# EAGLE design ftdi (EAGLE 6.1)
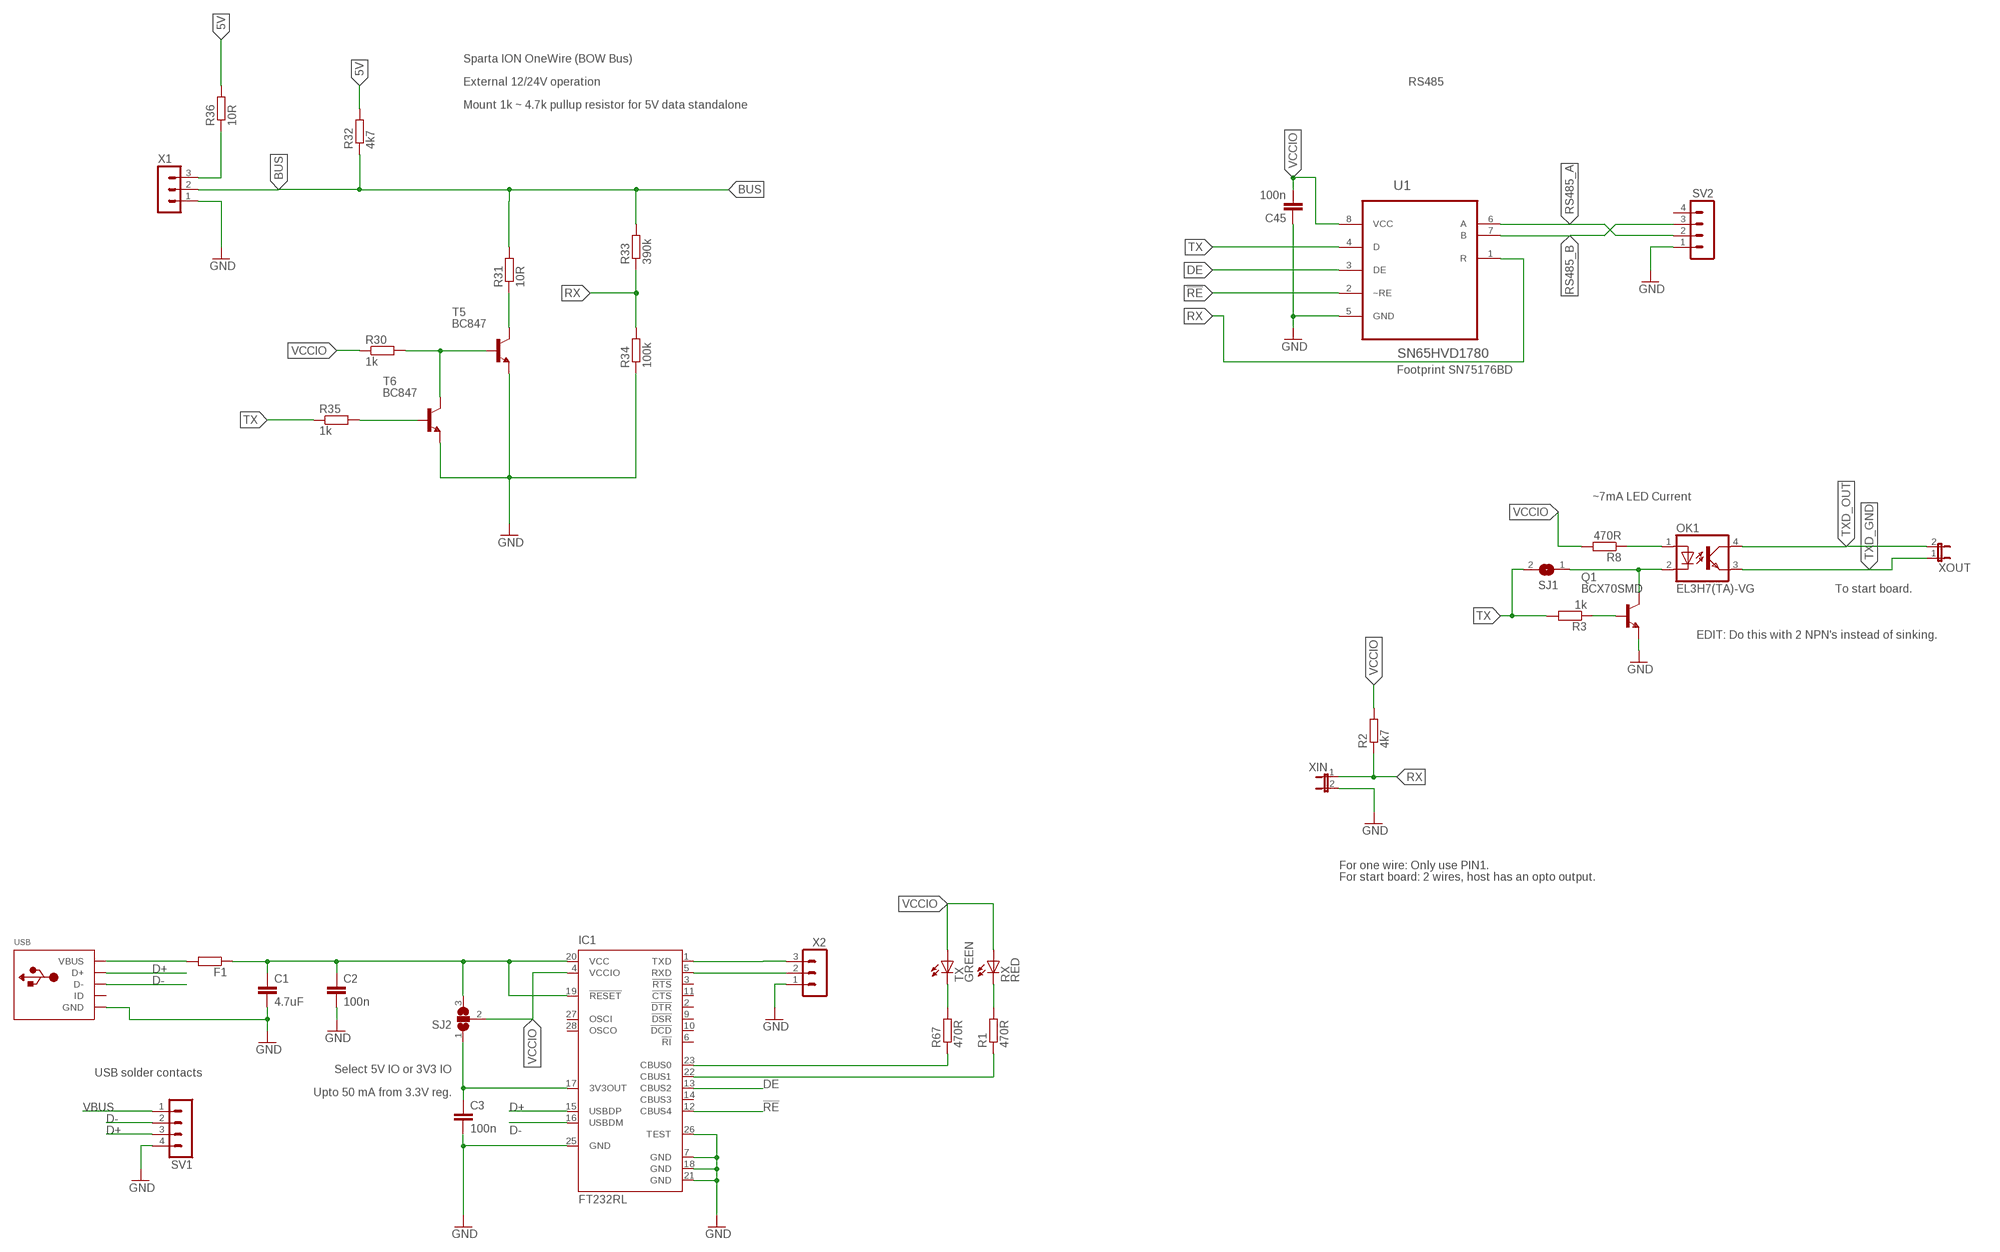
[diagram p0: schematic, sheet 1]

## Parts
C1  4.7uF  C-EUC0805  [C0805]
C2  100n  C-EUC0805  [C0805]
C3  100n  C-EUC0805  [C0805]
C45  100n  C-EUC0805  [C0805]
F1  R-EU_R0805  [R0805]
IC1  FT232RL  [SSOP28]
OK1  EL3H7(TA)-VG  TLP283  [MINI-FLAT-4]
Q1  BCX70SMD  [SOT23]
R1  470R  R-EU_M0805  [M0805]
R2  4k7  R-EU_R0805  [R0805]
R3  1k  R-EU_R0805  [R0805]
R8  470R  R-EU_R0805  [R0805]
R30  1k  R-EU_M0805  [M0805]
R31  10R  R-EU_M0805  [M0805]
R32  4k7  R-EU_M0805  [M0805]
R33  390k  R-EU_M0805  [M0805]
R34  100k  R-EU_M0805  [M0805]
R35  1k  R-EU_M0805  [M0805]
R36  10R  R-EU_M0805  [M0805]
R67  470R  R-EU_M0805  [M0805]
RX  RED  LEDCHIPLED_0805  [CHIPLED_0805]
SJ1  SJ  [SJ]
SJ2  SJ2W  [SJ_2]
SV1  MA04-1  [MA04-1]
SV2  MA04-1  [MA04-1]
T5  BC847  [SOT23]
T6  BC847  [SOT23]
TX  GREEN  LEDCHIPLED_0805  [CHIPLED_0805]
U1  SN65HVD1780  SN75176BD  [SOIC127P600X175-8N]
USB  ADAFRUIT_USBMINIB  [ADAFRUIT_USB-MINIB]
X1  MA03-1  [MA03-1]
X2  MA03-1  [MA03-1]
XIN  JP1E  [JP1]
XOUT  JP1E  [JP1]

## Nets
5V: C1.1 C2.1 F1.1 IC1.19(!RESET) IC1.20(VCC) R32.2 R36.2 SJ2.3
!RE: IC1.12(CBUS4) U1.2(~RE)
BUS: R31.2 R32.1 R33.2 X1.2
D+: IC1.15(USBDP) SV1.3 USB.D+
D-: IC1.16(USBDM) SV1.2 USB.D-
DE: IC1.13(CBUS2) U1.3(DE)
GND: C1.2 C2.2 C3.2 C45.1 IC1.7(GND) IC1.18(GND) IC1.21(GND) IC1.25(GND) IC1.26(TEST) Q1.2(E) R34.1 SV1.4 SV2.1 T5.2(E) T6.2(E) U1.5(GND) USB.GND X1.1 X2.1 XIN.2
GND1: IC1.23(CBUS0) R67.1
GND2: IC1.22(CBUS1) R1.1
N$1: C3.1 IC1.17(3V3OUT) SJ2.1
N$3: R1.2 RX.C
N$5: OK1.2(C) Q1.3(C) SJ1.1
N$6: OK1.1(A) R8.1
N$10: Q1.1(B) R3.1
N$14: R31.1 T5.3(C)
N$23: R35.2 T6.1(B)
N$25: R30.2 T5.1(B) T6.3(C)
N$28: R36.1 X1.3
N$74: R67.2 TX.C
RS485_A: SV2.2 U1.6(A)
RS485_B: SV2.3 U1.7(B)
RX: IC1.5(RXD) R2.1 R33.1 R34.2 U1.1(R) X2.2 XIN.1
TX: IC1.1(TXD) R3.2 R35.1 SJ1.2 U1.4(D) X2.3
TXD_GND: OK1.3(EMIT) XOUT.1
TXD_OUT: OK1.4(COL) XOUT.2
VBUS: F1.2 SV1.1 USB.VBUS
VCCIO: C45.2 IC1.4(VCCIO) R2.2 R8.2 R30.1 RX.A SJ2.2 TX.A U1.8(VCC)
Unconnected: IC1.2(!DTR) IC1.3(!RTS) IC1.6(!RI) IC1.9(!DSR) IC1.10(!DCD) IC1.11(!CTS) IC1.14(CBUS3) IC1.27(OSCI) IC1.28(OSCO) SV2.4 USB.ID

## Notes on the sheet
- Sparta ION OneWire (BOW Bus)
- External 12/24V operation | RS485
- Mount 1k ~ 4.7k pullup resistor for 5V data standalone
- Footprint SN75176BD
- ~7mA LED Current
- To start board.
- EDIT: Do this with 2 NPN's instead of sinking.
- For one wire: Only use PIN1.
- For start board: 2 wires, host has an opto output.
- Select 5V IO or 3V3 IO
- USB solder contacts
- Upto 50 mA from 3.3V reg.

## Library data of the parts
C1-C3 C45 = rcl:C-EU: CAPACITOR, European symbol
F1 R1-R3 R8 R30-R36 R67 = rcl:R-EU_: RESISTOR, European symbol
IC1 = ftdichip:FT232R: Source: http://www.ftdichip.com/Documents/DataSheets/DS_FT232R_v104.pdf; MPN: FT232RL; OC_FARNELL: 1146032; OC_NEWARK: 91K9918
OK1 = optocoupler:TLP283: TOSHIBA PHOTOCOUPLER GaAs IRED & PHOTO-TRANSISTOR Source: http://www.semicon.toshiba.co.jp/td/en/Opto/Photocoupler/en_20050928_TLP283_datasheet.pdf; OC_FARNELL: unknown; OC_NEWARK: unknown
Q1 = transistor-npn:BCX70*: NPN Transistor
RX TX = led:LED: LED OSRAM: - CHIPLED LG R971, LG N971, LY N971, LG Q971, LY Q971, LO R971, LY R971 LH N974, LH R974 LS Q976, LO Q976, LY Q976 LO Q996 - Hyper CHIPLED LW Q18S LB Q993, LB Q99A, LB R99A - SideLED LS A670, LO A670, LY A670, LG A670, LP A670 LB A673, LV A673, LT A673, LW A673 LH A674 LY A675 LS A676, LA A676, LO A676, LY A676, LW A676 LS A679, LY A679, LG A679 - Hyper Micro SIDELED® LS Y876, LA Y876, LO Y876, LY Y876 LT Y87S - SmartLED LW L88C, LW L88S LB L89C, LB L89S, LG L890 LS L89K, LO L89K, LY L89K LS L896, LA L896, LO L896, LY L896 - TOPLED LS T670, LO T670, LY T670, LG T670, LP T670 LSG T670, LSP T670, LSY T670, LOP T670, LYG T670 LG T671, LOG T671, LSG T671 LB T673, LV T673, LT T673, LW T673 LH T674 LS T676, LA T676, LO T676, LY T676, LB T676, LH T676, LSB T676, LW T676 LB T67C, LV T67C, LT T67C, LS T67K, LO T67K, LY T67K, LW E67C LS E67B, LA E67B, LO E67B, LY E67B, LB E67C, LV E67C, LT E67C LW T67C LS T679, LY T679, LG T679 LS T770, LO T770, LY T770, LG T770, LP T770 LB T773, LV T773, LT T773, LW T773 LH T774 LS E675, LA E675, LY E675, LS T675 LS T776, LA T776, LO T776, LY T776, LB T776 LHGB T686 LT T68C, LB T68C - Hyper Mini TOPLED® LB M676 - Mini TOPLED Santana® LG M470 LS M47K, LO M47K, LY M47K Source: http://www.osram.convergy.de LUXEON: - LUMILED® LXK2-PW12-R00, LXK2-PW12-S00, LXK2-PW14-U00, LXK2-PW14-V00 LXK2-PM12-R00, LXK2-PM12-S00, LXK2-PM14-U00 LXK2-PE12-Q00, LXK2-PE12-R00, LXK2-PE12-S00, LXK2-PE14-T00, LXK2-PE14-U00 LXK2-PB12-K00, LXK2-PB12-L00, LXK2-PB12-M00, LXK2-PB14-N00, LXK2-PB14-P00, LXK2-PB14-Q00 LXK2-PR12-L00, LXK2-PR12-M00, LXK2-PR14-Q00, LXK2-PR14-R00 LXK2-PD12-Q00, LXK2-PD12-R00, LXK2-PD12-S00 LXK2-PH12-R00, LXK2-PH12-S00 LXK2-PL12-P00, LXK2-PL12-Q00, LXK2-PL12-R00 Source: www.luxeon.com KINGBRIGHT: KA-3528ASYC Source: www.kingbright.com
SJ1 = jumper:SJ: SMD solder JUMPER
SJ2 = jumper:SJ2W: SMD solder JUMPER
SV1 SV2 = con-lstb:MA04-1: PIN HEADER; OC_FARNELL: unknown; OC_NEWARK: unknown
T5 T6 = transistor:BC847: NPN TRANSISTOR
U1 = components:SN75176BD: DIFFERENTIAL BUS TRANSCEIVER; MPN: SN75176BD; OC_FARNELL: 1103176; OC_NEWARK: 08F8127; PACKAGE: SOIC-8; SUPPLIER: Texas Instruments
USB = atmega32u4bb:ADAFRUIT_USB: USB Connectors USBMINIB - Surface Mount Female Mini-B USB Connector 4UConnector: 06564 By microbuilder.eu Thru-hole RA Female Mini-B USB Connector 4UConnector: 18732 By ladyada.net
X1 X2 = con-lstb:MA03-1: PIN HEADER; OC_FARNELL: unknown; OC_NEWARK: unknown
XIN XOUT = jumper:JP1E: JUMPER

## Board
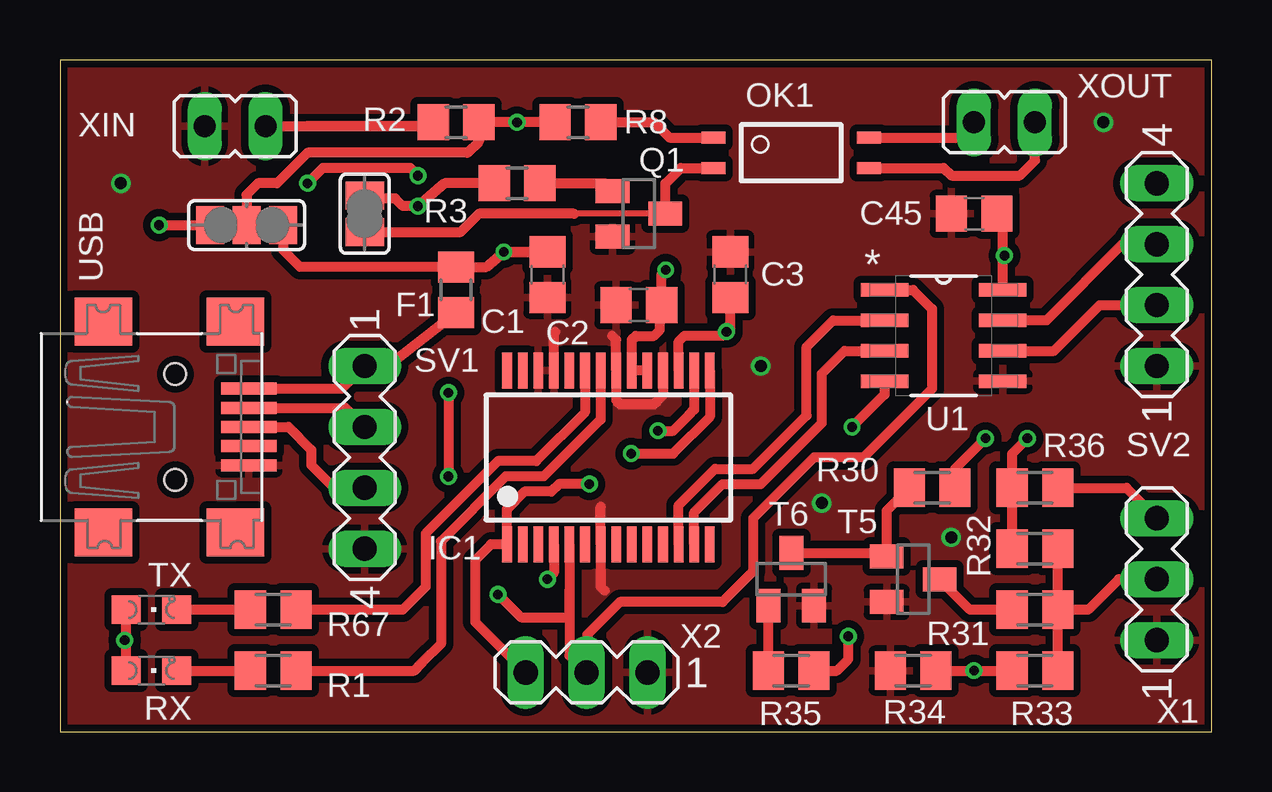
[diagram p1: board, top side]
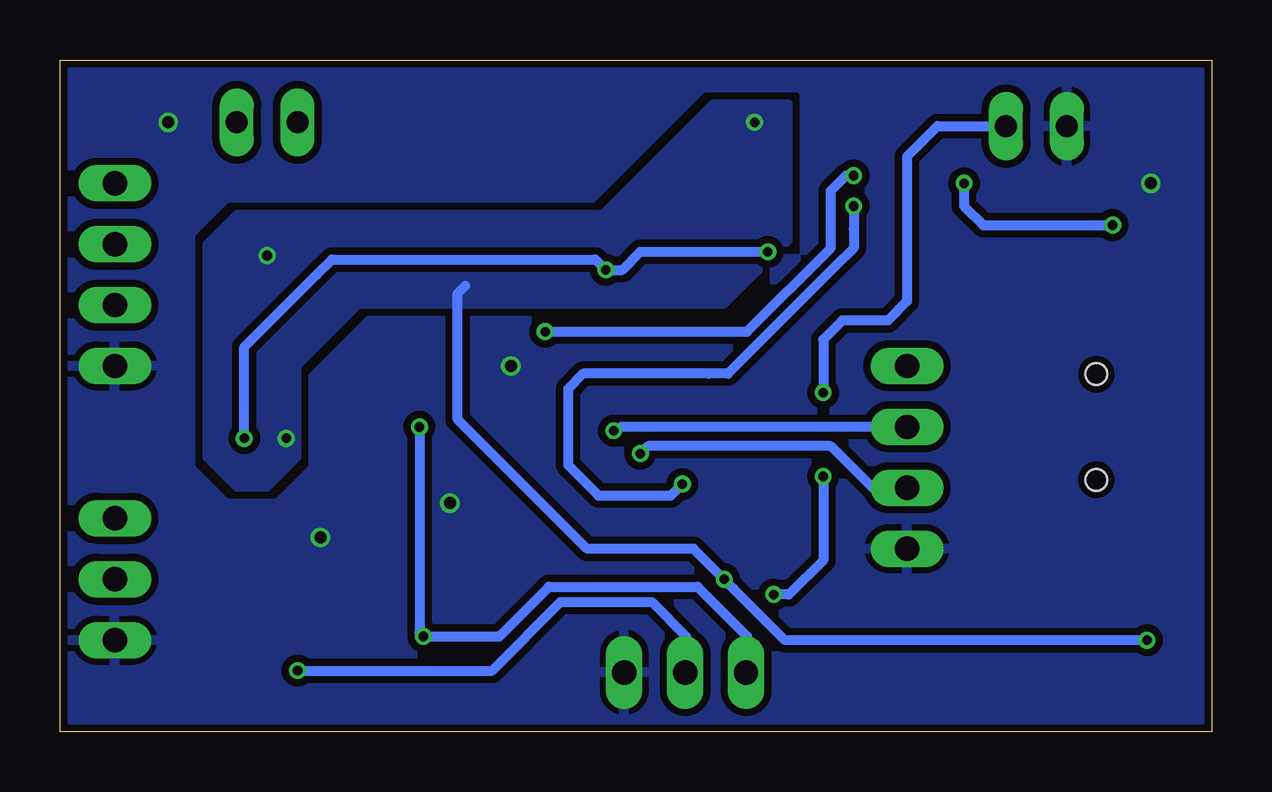
[diagram p2: board, bottom side, seen from below]

Size 48 x 28 mm. Coordinates in mm from the lower left corner, seen from the top.
Outline: 0,0 48,0 48,28 0,28 0,0
Copper layers (1*16): Top 0.035mm / dielectric 1.5mm / Bottom 0.035mm
Design rules: minimum track width 6mil, minimum drill 12mil, track to track 6mil, track to pad 6mil, pad to pad 6mil, via to via 6mil, smd to smd 0mil, copper to edge 10mil, drill to drill 10mil, minimum pad ring 10mil, minimum via ring 6mil, stop-mask expansion 2mil, vias tented up to drill 100mil, thermal gap 10mil

### Footprints (pad centres in the part's own frame; a part is rotated, then mirrored left to right if it is on the bottom)
C0805 = smd 1.3 x 1.5: 1 -0.95,0; 2 0.95,0
R0805 = smd 1.3 x 1.5: 1 -0.95,0; 2 0.95,0
SSOP28 = smd 0.4 x 1.5: 1 -4.225,-3.625; 2 -3.575,-3.625; 3 -2.925,-3.625; 4 -2.275,-3.625; 5 -1.625,-3.625; 6 -0.975,-3.625; 7 -0.325,-3.625; 8 0.325,-3.625; 9 0.975,-3.625; 10 1.625,-3.625; 11 2.275,-3.625; 12 2.925,-3.625; 13 3.575,-3.625; 14 4.225,-3.625; 15 4.225,3.625; 16 3.575,3.625; 17 2.925,3.625; 18 2.275,3.625; 19 1.625,3.625; 20 0.975,3.625; 21 0.325,3.625; 22 -0.325,3.625; 23 -0.975,3.625; 24 -1.625,3.625; 25 -2.275,3.625; 26 -2.925,3.625; 27 -3.575,3.625; 28 -4.225,3.625
MINI-FLAT-4 = smd 1 x 0.5: 1 -3.24,0.635; 2 -3.24,-0.635; 3 3.24,-0.635; 4 3.24,0.635
SOT23 = smd 1 x 1.4: 1 -0.95,-1.1; 2 0.95,-1.1; 3 0,1.1
M0805 = smd 1.3 x 1.6: 1 -0.95,0; 2 0.95,0
CHIPLED_0805 = smd 1.2 x 1.2: A 0,-1.05; C 0,1.05
SJ = smd 1.168 x 1.6: 1 -0.762,0; 2 0.762,0
SJ_2 = smd 1.168 x 1.6: 1 -1.524,0; 2 0,0; 3 1.524,0
MA04-1 = drill 1.016 long: 1 -3.81,0; 2 -1.27,0; 3 1.27,0; 4 3.81,0
SOIC127P600X175-8N = smd 1.981 x 0.559: 1 -2.464,1.905; 2 -2.464,0.635; 3 -2.464,-0.635; 4 -2.464,-1.905; 5 2.464,-1.905; 6 2.464,-0.635; 7 2.464,0.635; 8 2.464,1.905
ADAFRUIT_USB-MINIB = smd 0.5 x 2.308: D+ 0,4.064; D- -0.8,4.064; GND 1.6,4.064; ID 0.8,4.064; VBUS -1.6,4.064 | smd 2 x 2.4: GND1 -4.4,-2; GND2 -4.4,3.5; GND3 4.4,3.5; GND4 4.4,-2 | hole 0.9: -2.2,1; 2.2,1
MA03-1 = drill 1.016 long: 1 -2.54,0; 2 0,0; 3 2.54,0
JP1 = drill 0.914 long: 1 0,-1.27; 2 0,1.27

### Placement (x,y rotation side)
C1  20.32,19.05 270 top
C2  24.13,17.78 180 top
C3  27.94,19.05 90 top
C45  38.1,21.59 0 top
F1  16.51,18.41 270 top
IC1  22.86,11.43 0 top
OK1  30.48,24.13 0 top
Q1  24.13,21.59 270 top
R1  8.89,2.54 180 top
R2  16.51,25.4 0 top
R3  19.05,22.86 180 top
R8  21.59,25.4 180 top
R30  36.35,10.16 180 top
R31  40.64,5.08 0 top
R32  40.64,7.62 180 top
R33  40.64,2.54 0 top
R34  35.56,2.54 0 top
R35  30.48,2.54 180 top
R36  40.64,10.16 180 top
R67  8.89,5.08 180 top
RX  3.81,2.54 270 top
SJ1  12.7,21.59 90 top
SJ2  7.78,21.11 0 top
SV1  12.7,11.43 270 top
SV2  45.72,19.05 90 top
T5  35.56,6.35 270 top
T6  30.48,6.35 0 top
TX  3.81,5.08 270 top
U1  36.83,16.51 0 top
USB  3.81,12.7 270 top
X1  45.72,6.35 90 top
X2  21.95,2.46 180 top
XIN  7.3,25.24 90 top
XOUT  39.37,25.4 90 top

### Tracks (layer width: path | path; a pad name or v marks a point on that pad's centre or on a via)
5V  (via drill 0.4)
  Top 0.406: v18.5,20 17.78,19.37 17.78,19.36 F1.1 14.6,19.36 10.95,19.37 10,19.37 9.37,20 9.3,20.07 SJ2.3 | v18.5,20 C1.1 v18.5,20 | R32.2 R36.2 39.69,11.59 v40.32,12.22 | IC1.19 IC1.20 23.84,16.34 24,16.5 24.75,16.5 25,16.75 25,17.7 C2.1 25.08,19.08 v25.25,19.25
  Bottom 0.406: v40.32,12.22 40.32,16.03 37.31,19.05 36.67,19.68 25.68,19.68 v25.25,19.25 24.57,19.25 23.81,20 v18.5,20
!RE
  Top 0.406: IC1.12 25.79,9.43 27.3,10.95 28.89,10.95 31.11,13.18 31.11,16.03 32.23,17.14 U1.2
BUS
  Top 0.406: R33.2 R31.2 | R31.2 R32.1 | X1.2 44.13,6.35 42.86,5.08 R31.2
D+  (via drill 0.4)
  Top 0.406: USB.D+ 9.53,12.7 10.48,11.75 10.48,11.11 11.43,10.16 SV1.3 | v23.81,11.59 25.24,11.59 25.56,11.59 27.09,13.12 IC1.15
  Bottom 0.406: SV1.3 14.13,10.16 15.88,11.91 23.5,11.91 v23.81,11.59
D-  (via drill 0.4)
  Top 0.406: USB.D- 11.9,13.5 SV1.2 | v24.92,12.54 25.56,12.54 26.19,13.18 26.43,13.42 IC1.16
  Bottom 0.406: SV1.2 24.61,12.7 v24.92,12.54
DE
  Top 0.406: IC1.13 26.43,9.13 27.62,10.32 29.21,10.32 31.75,12.86 31.75,14.92 32.7,15.88 U1.3
GND  (via drill 0.5)
  Top 0.406: 22.7,5.87 22.54,6.04 IC1.7 22.54,9.36 22.54,9.37 | 20.64,16.67 20.59,16.62 IC1.25 | 23.02,16.51 23.18,16.34 IC1.21 23.18,13.8 23.34,13.65 24.45,13.65 24.77,13.65 24.92,13.81 25.14,14.02 IC1.18
  other vias: 2.54,22.86 29.21,15.24 31.75,9.53 37.15,8.1 43.5,25.4
  pour Top (isolate 0.305, rank 6): -1.27,29.21 -1.27,-1.27 49.53,-1.27 49.53,29.21
  pour Bottom (isolate 0.305, rank 6): -1.27,29.21 -1.27,-1.27 49.53,-1.27 49.53,29.21
GND1
  Top 0.406: IC1.23 21.89,13.31 19.84,11.27 18.26,11.27 15.24,8.26 15.24,6.03 14.29,5.08 10.16,5.08 R67.1
GND2
  Top 0.406: IC1.22 22.54,13.01 20.16,10.64 18.57,10.64 15.88,7.94 15.88,3.65 15.08,2.86 14.76,2.54 R1.1
N$1  (via drill 0.4)
  Top 0.406: IC1.17 25.79,16.26 | 25.79,16.26 26.04,16.51 | 26.04,16.51 27.62,16.51 | 27.62,16.51 v27.78,16.67 | v27.78,16.67 27.94,16.83 C3.1 | 25.79,16.26 26.04,16.51 | 26.04,16.51 27.62,16.51 | 27.62,16.51 v27.78,16.67 | v14.92,23.18 14.61,23.5 10.95,23.5 v10.32,22.86 | v4.13,21.11 5.87,21.11 | 5.87,21.11 6.35,21.59 | SJ2.1 5.87,21.11
  Bottom 0.406: v27.78,16.67 20.16,16.67 19.37,16.67 15.88,20.16 15.88,20.95 15.88,22.54 15.24,23.18 v14.92,23.18 | v10.32,22.86 10.32,21.91 9.53,21.11 v4.13,21.11
N$3
  Top 0.406: RX.C R1.2
N$5
  Top 0.254: Q1.3 21.43,21.59
  Top 0.406: Q1.3 25.23,22.85 25.88,23.5 OK1.2 | SJ1.1 16.7,20.83 17.46,21.59 21.43,21.59
N$6
  Top 0.406: R8.1 24.77,25.4 25.4,24.77 OK1.1
N$10
  Top 0.406: R3.1 22.71,22.86 Q1.1
N$14
  Top 0.406: R31.1 37.93,5.08 T5.3
N$23
  Top 0.406: R35.2 T6.1
N$25
  Top 0.406: T6.3 34.31,7.45 T5.1 34.46,9.22 R30.2
N$28
  Top 0.406: R36.1 44.45,10.16 X1.3
N$74
  Top 0.406: R67.2 TX.C
RS485_A
  Top 0.406: U1.6 41.43,15.88 43.34,17.78 SV2.2
RS485_B
  Top 0.406: SV2.3 44.29,20.32 41.12,17.14 U1.7
RX  (via drill 0.4)
  Top 0.406: IC1.5 21.23,5.87 | 21.23,5.87 21.23,4.76 | 21.23,4.76 21.23,3.17 X2.2 21.99,2.5 21.99,4.05 23.34,5.4 27.62,5.4 28.89,6.67 28.89,8.89 31.43,11.43 33.5,11.43 36.35,14.29 36.35,17.62 35.56,18.41 U1.1 | v38.1,2.54 R34.2 v38.1,2.54 | v38.1,2.54 R33.1 | XIN.1 15.4,25.24 | 15.4,25.24 R2.1 | 15.4,25.24 10.32,25.24 | v16.19,14.13 v16.19,10.64 | v18.26,5.71 19.21,4.76 21.23,4.76 | 21.23,4.76 21.23,5.87
  Bottom 0.406: v38.1,2.54 30,2.54 27.15,5.4 23.34,5.4 21.91,3.97 21.91,2.5 X2.2 | v16.19,14.13 16.19,16.35 15.4,17.14 13.49,17.14 12.7,17.94 12.7,18.57 12.7,23.97 11.43,25.24 XIN.1 | v16.19,10.64 16.19,7.14 17.62,5.71 v18.26,5.71
TX  (via drill 0.4)
  Top 0.406: R35.1 32.38,2.54 32.86,3.02 v32.86,3.97 | U1.4 34.37,14.05 v33.02,12.7 | SJ1.2 13.21,22.23 13.97,22.23 14.29,21.91 v14.92,21.91 16.03,22.86 R3.2 | v22.07,10.32 20.8,10.32 20.48,10 19.37,10 18.64,9.27 IC1.1 17.96,7.8 17.3,7.14 17.3,4.57 X2.3
  Bottom 0.406: X2.3 19.37,2.5 19.37,3.97 21.43,6.03 27.62,6.03 29.69,3.97 v32.86,3.97 33.02,4.13 v33.02,12.7 | v14.92,21.91 14.92,20.95 14.92,20.16 15.72,19.37 15.88,19.21 20.16,14.92 20.95,14.92 26.19,14.92 26.83,14.29 26.83,11.11 25.56,9.84 22.54,9.84 22.23,10.16 v22.07,10.32
TXD_GND
  Top 0.406: OK1.3 36.83,23.5 37.15,23.18 40.01,23.18 40.64,23.81 XOUT.1
TXD_OUT
  Top 0.406: OK1.4 37.47,24.77 XOUT.2
VBUS
  Top 0.406: F1.2 13.65,15.24 SV1.1 11.76,14.3 USB.VBUS
VCCIO  (via drill 0.4)
  Top 0.406: TX.A RX.A 2.76,3.75 v2.7,3.81 | C45.2 39.29,21.35 U1.8 39.29,19.77 v39.37,19.84 | R30.1 37.3,10.95 v38.58,12.22 | SJ2.2 7.78,22.38 8.26,22.86 9.05,22.86 10.32,24.13 16.99,24.13 17.46,24.6 R2.2 v19.05,25.4 R8.2 | IC1.4 20.59,6.62 v20.32,6.35
  Bottom 0.406: v2.7,3.81 17.78,3.81 19.92,5.95 | 19.92,5.95 v20.32,6.35 | v20.32,6.35 21.59,7.62 26.04,7.62 31.43,13.02 31.43,18.26 31.11,18.57 | v38.58,12.22 38.58,12.38 | v20.32,6.35 19.92,5.95
  pour Bottom (isolate 0.305, rank 4): 17.62,26.19 17.62,20.48 20.32,17.78 35.56,17.78 38.1,15.24 38.1,11.43 39.37,10.16 40.64,10.16 41.91,11.43 41.91,20.32 40.64,21.59 25.4,21.59 20.8,26.19

### Text on the board
tDocu: - | + | + | - | B | 3V | 5V | A | 5V | 0V | - | + | 5V | 0V | D | TX RX 0V | 0V